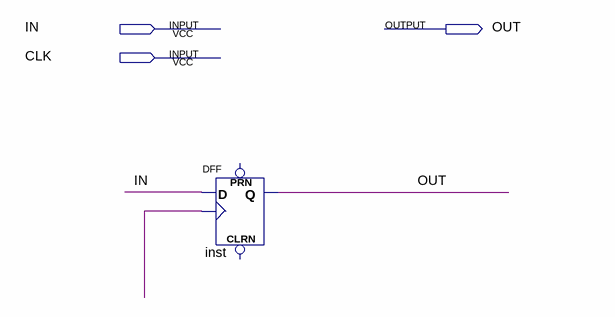
[diagram p0: schematic sheet]
// Quartus schematic g27_hold_2_clk.bdf as structural Verilog: 1 symbols, 3 pins
module g27_hold_2_clk (
  input  IN,
  input  CLK,
  output OUT
);

  wire undriven;

  DFF inst (.CLK(undriven), .D(IN), .Q(OUT));  // open: CLRN, PRN
endmodule
